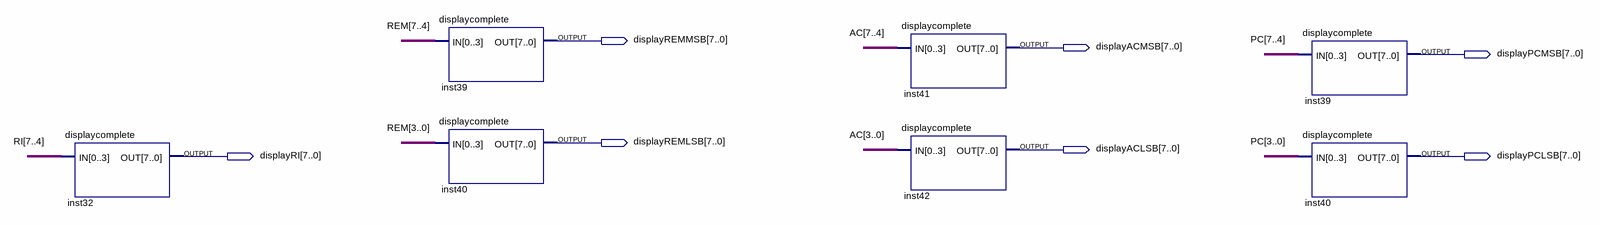
[diagram p0: schematic sheet]
// Quartus schematic aaa.bdf as structural Verilog: 7 symbols, 7 pins
module aaa (
  output [7:0] displayREMMSB,
  output [7:0] displayACMSB,
  output [7:0] displayPCMSB,
  output [7:0] displayREMLSB,
  output [7:0] displayACLSB,
  output [7:0] displayRI,
  output [7:0] displayPCLSB
);

  wire [7:0] AC, PC, REM;
  wire [7:4] RI;

  displaycomplete inst32 (.IN(RI), .OUT(displayRI));
  displaycomplete inst39 (.IN(REM[7:4]), .OUT(displayREMMSB));
  displaycomplete inst40 (.IN(REM[3:0]), .OUT(displayREMLSB));
  displaycomplete inst41 (.IN(AC[7:4]), .OUT(displayACMSB));
  displaycomplete inst42 (.IN(AC[3:0]), .OUT(displayACLSB));
  displaycomplete inst39_dup2 (.IN(PC[7:4]), .OUT(displayPCMSB));
  displaycomplete inst40_dup2 (.IN(PC[3:0]), .OUT(displayPCLSB));
endmodule
